# Altium schematic sheet Sheet1.SchDoc (part 3 of 3)
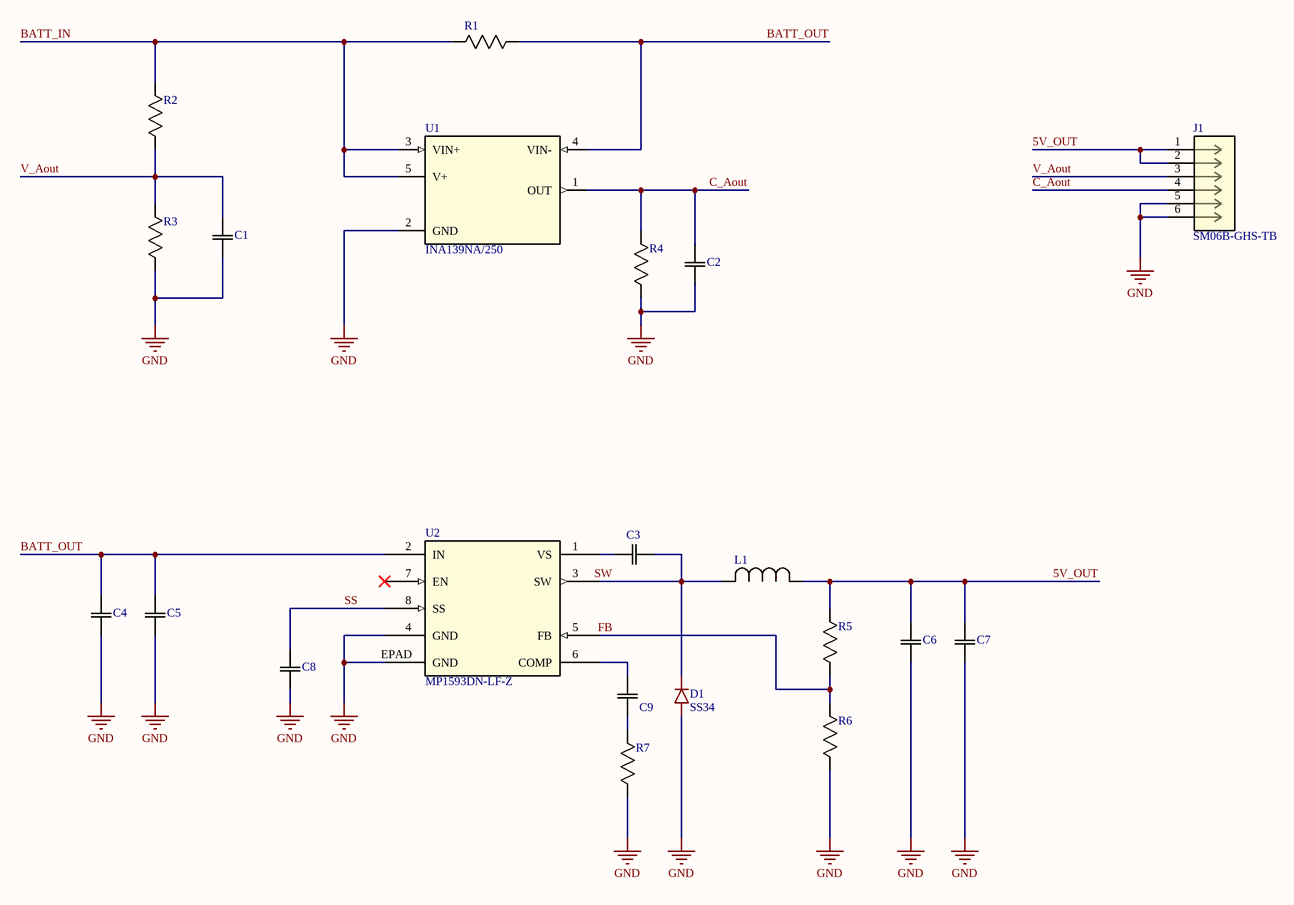
[diagram p2: Sheet1.SchDoc]

## Library data of the parts (continued)
R7 = RK73H1ETTP7501F: Res Thick Film 0402 7.5K Ohm 1% 0.1W(1/10W) ±100ppm/C Pad SMD Automotive T/R; Manufacturer: KOA Speer; Power Dissipation: 100mW; Power Rating: 63mW; Value: 7.5kΩ; Temperature Coefficient: 100ppm/°C; Voltage Rating: 50V; Working Voltage: 75V; Supplier: DigiKey; Supplier Part Number: 2019-RK73H1ETTP7501FCT-ND; Manufacturer Part Number: RK73H1ETTP7501F; RoHS: Compliant; Category: Chip SMD Resistors; Stock: 83640; Pricing: 1=0.1, 10=0.027, 25=0.0196, 50=0.0158, 100=0.0129, 250=0.01004, 500=0.0084, 1000=0.00713, 5000=0.00544 (USD); Case/Package: 0402; Case Code (Imperial): 0402; Case Code (Metric): 1005; China RoHS: Non-Compliant; Composition: Thick Film; Depth: 500µm; Height: 350µm; Lead Free: Lead Free; Length: 1mm; Lifecycle Status: Production; Max Operating Temperature: 155°C; Military Standard: Not; Min Operating Temperature: -55°C; Mounting Technology: Surface Mount; Number of Terminals: 2; REACH SVHC: Yes; Schedule B: 8533210045, 8533210045|8533210045|8533210045|8533210045|8533210045|8533210045|8533210045|8533210045|8533210045|8533210045|8533210045|8533210045|8533210045|8533210045|8533210045|8533210045|8533210045|8533210045|8533210045|8533210045|8533210045|8533210045|8533210045|85; Termination: SMD/SMT; Tolerance: 1%; Voltage Rating (DC): 50V; Width: 500µm; ComponentLink1URL: https://datasheet.octopart.com:443/RK73H1ETTP7501F-KOA-Speer-datasheet-181956035.pdf?src-supplier=IHS; ComponentLink1Description: https://datasheet.octopart.com:443/RK73H1ETTP7501F-KOA-Speer-datasheet-181956035.pdf?src-supplier=IHS; ComponentLink2URL: https://datasheet.octopart.com:443/RK73H1ETTP7501F-KOA-Speer-datasheet-11590619.pdf?src-supplier=Upverter; ComponentLink2Description: https://datasheet.octopart.com:443/RK73H1ETTP7501F-KOA-Speer-datasheet-11590619.pdf?src-supplier=Upverter; ComponentLink3URL: https://datasheet.octopart.com:443/RK73H1ETTP7501F-KOA-Speer-datasheet-188906116.pdf?src-supplier=TME; ComponentLink3Description: https://datasheet.octopart.com:443/RK73H1ETTP7501F-KOA-Speer-datasheet-188906116.pdf?src-supplier=TME; ComponentLink4URL: https://datasheet.octopart.com:443/RK73H1ETTP7501F-KOA-Speer-datasheet-149653815.pdf?src-supplier=Newark; ComponentLink4Description: https://datasheet.octopart.com:443/RK73H1ETTP7501F-KOA-Speer-datasheet-149653815.pdf?src-supplier=Newark; ComponentLink5URL: https://datasheet.octopart.com:443/RK73H1ETTP7501F-KOA-Speer-datasheet-155997623.pdf?src-supplier=Future+Electronics; ComponentLink5Description: https://datasheet.octopart.com:443/RK73H1ETTP7501F-KOA-Speer-datasheet-155997623.pdf?src-supplier=Future+Electronics; ComponentLink6URL: https://datasheet.octopart.com:443/RK73H1ETTP7501F-KOA-Speer-datasheet-11541643.pdf?src-supplier=Arrow+Electronics; ComponentLink6Description: https://datasheet.octopart.com:443/RK73H1ETTP7501F-KOA-Speer-datasheet-11541643.pdf?src-supplier=Arrow+Electronics; ComponentLink7URL: https://datasheet.octopart.com:443/RK73H1ETTP7501F-KOA-Speer-datasheet-5377299.pdf?src-supplier=Garrett; ComponentLink7Description: https://datasheet.octopart.com:443/RK73H1ETTP7501F-KOA-Speer-datasheet-5377299.pdf?src-supplier=Garrett; ComponentLink8URL: https://datasheet.octopart.com:443/RK73H1ETTP7501F-KOA-Speer-datasheet-148194.pdf?src-supplier=Garrett; ComponentLink8Description: https://datasheet.octopart.com:443/RK73H1ETTP7501F-KOA-Speer-datasheet-148194.pdf?src-supplier=Garrett; ComponentLink9URL: https://datasheet.octopart.com:443/RK73H1ETTP7501F-KOA-Speer-datasheet-109211.pdf?src-supplier=Garrett; ComponentLink9Description: https://datasheet.octopart.com:443/RK73H1ETTP7501F-KOA-Speer-datasheet-109211.pdf?src-supplier=Garrett; ComponentLink10URL: http://sigma.octopart.com:80/rohs_statement/KOA-Speer-company-17.pdf?src-supplier=Compliance+Statements; ComponentLink10Description: http://sigma.octopart.com:80/rohs_statement/KOA-Speer-company-17.pdf?src-supplier=Compliance+Statements
U1 = INA139NA250: 2.7 to 36V, 440kHz Variable gain current sense amplifier 5-SOT-23 -40 to 125; Manufacturer_Name: Texas Instruments; TYPE: TYPE; RefDes: RefDes; Copyright: Copyright (C) 2025 Ultra Librarian. All rights reserved.; Manufacturer_Part_Number: INA139NA/250; Datasheet: https://www.ti.com/lit/gpn/ina139
U2 = MP1593DN-LF-Z: 3A 28V 385KHz Step-Down Converter; Manufacturer_Name: Monolithic Power Systems; Copyright: Copyright (C) 2025 Ultra Librarian. All rights reserved.; Manufacturer_Part_Number: MP1593DN-LF-Z; Datasheet: https://www.monolithicpower.com/en/documentview/productdocument/index/version/2/document_type/Datasheet/lang/en/sku/MP1593; RefDes: RefDes; Type: Type